# Altium schematic sheet actuators.SchDoc
size A4; SheetNumber: 10; SheetTotal: 13
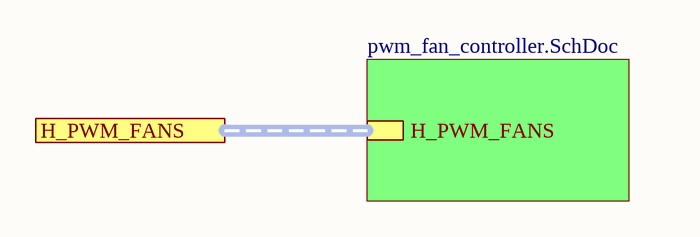
[diagram p0: actuators.SchDoc]

## Sub-sheets
pwm_fan_controller = pwm_fan_controller.SchDoc: H_PWM_FANS (harness H_PWM_FANS)

## Ports
H_PWM_FANS (harness H_PWM_FANS)

## Buses and harness runs
harness port H_PWM_FANS = sheet pwm_fan_controller/H_PWM_FANS